# Altium schematic sheet LatchDelay.SchDoc
size Letter; DocumentNumber: 4; SheetNumber: 4; SheetTotal: 7
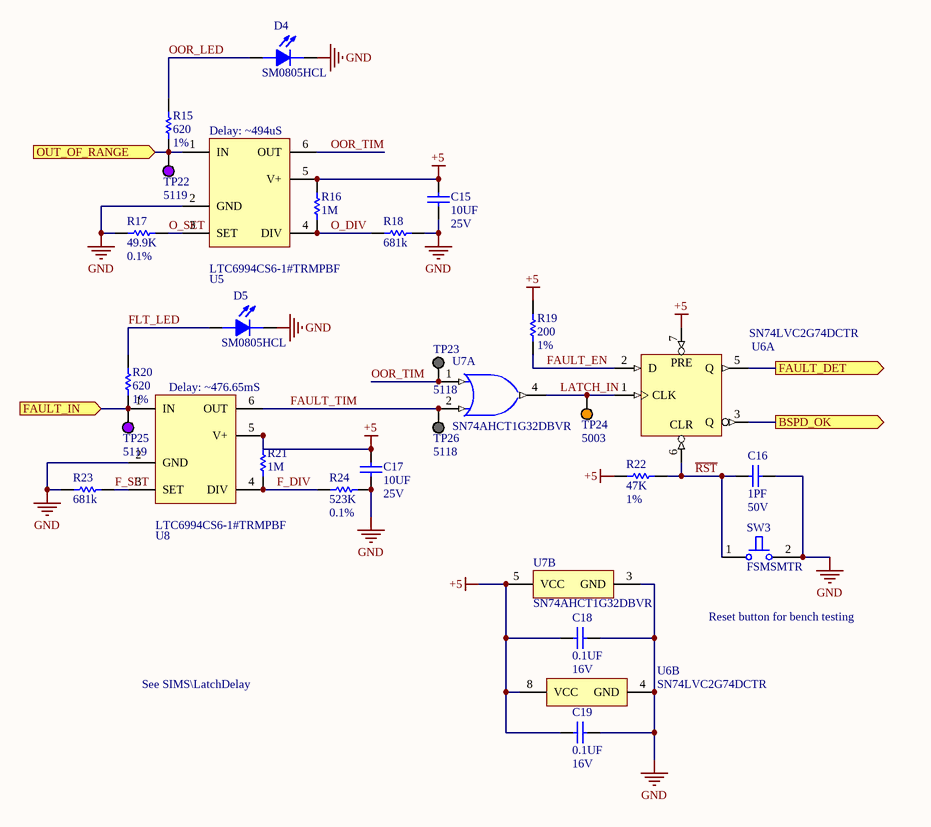
[diagram p0: LatchDelay.SchDoc]

## Parts
C15  Val: 10UF  Vol: 25V  [0603_CAP]  (hidden comment: CAP 0603 10UF 25V 20% X5R)
C16  Val: 1PF  Vol: 50V  [0603_CAP]  (hidden comment: CAP 0603 1PF 50V 0.05PF MLO)
C17  Val: 10UF  Vol: 25V  [0603_CAP]  (hidden comment: CAP 0603 10UF 25V 20% X5R)
C18  Val: 0.1UF  Vol: 16V  [0603_CAP]  (hidden comment: CAP 0603 0.1UF 16V 10% X7R)
C19  Val: 0.1UF  Vol: 16V  [0603_CAP]  (hidden comment: CAP 0603 0.1UF 16V 10% X7R)
D4  SM0805HCL  [LEDC2012X135N_SM0805HCL(Primary)]
D5  SM0805HCL  [LEDC2012X135N_SM0805HCL(Primary)]
R15  Val: 620  Tol: 1%  [0603_RES]  (hidden comment: RES 0603 620 1%)
R16  value 1M  [RESC2013X60X35ML10T20]  (hidden comment: RT0805BRE071ML)
R17  Val: 49.9K  Tol: 0.1%  [0603_RES]  (hidden comment: RES 0603 49.9K 0.1%)
R18  value 681k  [RESC2013X60X40NL20T25]  (hidden comment: ERA6AEB6813V)
R19  Val: 200  Tol: 1%  [0603_RES]  (hidden comment: RES 0603 200 1%)
R20  Val: 620  Tol: 1%  [0603_RES]  (hidden comment: RES 0603 620 1%)
R21  value 1M  [RESC2013X60X35ML10T20]  (hidden comment: RT0805BRE071ML)
R22  Val: 47K  Tol: 1%  [0603_RES]  (hidden comment: RES 0603 47K 1%)
R23  value 681k  [RESC2013X60X40NL20T25]  (hidden comment: ERA6AEB6813V)
R24  Val: 523K  Tol: 0.1%  [0805_RES]  (hidden comment: RES 0805 523K 0.1%)
SW3  FSMSMTR  [TECO-FSMSMTR_V]
TP22  5119  [KSTN-5119]
TP23  5118  [KSTN-5118]
TP24  5003  [KSTN-5003]
TP25  5119  [KSTN-5119]
TP26  5118  [KSTN-5118]
U5  LTC6994CS6-1#TRMPBF  [Linear_Technologies_LTC6994CS6-1#TRMPBF_0]  (value not drawn)
U6  SN74LVC2G74DCTR  [DCT0008A_M]  (parts A,B of 2)
U7  SN74AHCT1G32DBVR  [DBV0005A_M]  (parts A,B of 2)
U8  LTC6994CS6-1#TRMPBF  [Linear_Technologies_LTC6994CS6-1#TRMPBF_0]  (value not drawn)

## Ports
BSPD_OK (out), FAULT_DET (out), FAULT_IN (in), OUT_OF_RANGE (in)

## Nets
+5: C15.2 C17.2 C18.2 C19.2 R16.2 R19.2 R21.2 R22.1 U5.5(V+) U6.7(~{PRE}) U6.8(VCC) U7.5(VCC) U8.5(V+)
GND: C15.1 C16.2 C17.1 C18.1 C19.1 D4.C D5.C R17.1 R18.2 R23.1 R24.2 SW3.2 U5.2(GND) U6.4(GND) U7.3(GND) U8.2(GND)
~{RST}: C16.1 R22.2 SW3.1 U6.6(~{CLR})
BSPD_OK: U6.3(Q) ; port BSPD_OK
F_DIV: R21.1 R24.1 U8.4(DIV)
F_SET: R23.2 U8.3(SET)
FAULT_DET: U6.5(Q) ; port FAULT_DET
FAULT_EN: R19.1 U6.2(D)
FAULT_IN: R20.1 TP25.1 U8.1(IN) ; port FAULT_IN
FAULT_TIM: TP26.1 U7.2(B) U8.6(OUT)
FLT_LED: D5.A R20.2
LATCH_IN: TP24.1 U6.1(CLK) U7.4(Y)
O_DIV: R16.1 R18.1 U5.4(DIV)
O_SET: R17.2 U5.3(SET)
OOR_LED: D4.A R15.2
OOR_TIM: TP23.1 U5.6(OUT) U7.1(A)
OUT_OF_RANGE: R15.1 TP22.1 U5.1(IN) ; port OUT_OF_RANGE

## Notes on the sheet
- (near U5) Delay: ~494uS
- (near U8) Delay: ~476.65mS
- Reset button for bench testing
- See SIMS\LatchDelay
- Title:
- Size:
- Date:
- Desc:
- Letter
- Auth:
- Sheet
- Proj:
- of
- www.uvmaero.org
- File:
- (in symbol CMP-0859-00537-3, part A) PRE; CLR

## Library data of the parts
C15 C17 = CAP 0603 10UF 25V 20% X5R: Capacitor Surface Mount 0603 Footprint 10UF 25V 20% Tolerance Ceramic X5R; Manufacturer: Various; PCB Package: 0603; Description in Visual: Cap SMT 0603 10UF 25V 20% Ceramic X5R; P/N: CAP 0603 10UF 25V 20% X5R; Manufacturer P/N: Various; Value: 10UF; Voltage: 25V; Tolerance: 20%; Type: Ceramic X5R; ComponentLink1Description: Manufacturer Website; ComponentLink2Description: Component Datasheet; ComponentLink3Description: Octopart Link
C16 = CAP 0603 1PF 50V 0.05PF MLO: Capacitor Surface Mount 0603 Footprint 1PF 50V 0.05PF Tolerance MLO; Manufacturer: Various; PCB Package: 0603; Description in Visual: Cap SMT 0603 1PF 50V 0.05PF  MLO; P/N: CAP 0603 1PF 50V 0.05PF MLO; Manufacturer P/N: Various; Value: 1PF; Voltage: 50V; Tolerance: 0.05PF; Type: MLO; ComponentLink1Description: Manufacturer Website; ComponentLink2Description: Component Datasheet; ComponentLink3Description: Octopart Link
C18 C19 = CAP 0603 0.1UF 16V 10% X7R: Capacitor Surface Mount 0603 Footprint 0.1UF 16V 10% Tolerance Ceramic X7R; Manufacturer: Various; PCB Package: 0603; Description in Visual: Cap SMT 0603 0.1UF 16V 10%  Cer X7R; P/N: CAP 0603 0.1UF 16V 10% X7R; Manufacturer P/N: Various; Value: 0.1UF; Voltage: 16V; Tolerance: 10%; Type: Ceramic X7R; ComponentLink1Description: Manufacturer Website; ComponentLink2Description: Component Datasheet; ComponentLink3Description: Octopart Link
D4 D5 = SM0805HCL: Red 631nm LED Indication - Discrete 1.9V 0805 (2012 Metric); Supplier 1: Digi-Key; Supplier Part Number 1: 492-2281-1-ND
R15 R20 = RES 0603 620 1%: Resistor Surface Mount, 620 Ohms, 0603 Footprint, 1% Tolerance 0.1W; Manufacturer: Various; PCB Package: 0603; Description in Visual: Res SMT 620 0603  1%  0.1W; Value: 620; P/N: RES 0603 620 1%; Manufacturer P/N: Various; Power_Rating: 0.1W; Tolerance: 1%
R16 R21 = CMP-2001-01491-1: Manufacturer: Yageo; Part Number: RT0805BRE071ML
R17 = RES 0603 49.9K 0.1%: Resistor Surface Mount, 49.9K Ohms, 0603 Footprint, 0.1% Tolerance 0.1W; Manufacturer: Various; PCB Package: 0603; Description in Visual: Res SMT 49.9K 0603  0.1%  0.1W; P/N: RES 0603 49.9K 0.1%; Manufacturer P/N: Various; Value: 49.9K; Power_Rating: 0.1W; Tolerance: 0.1%
R18 R23 = CMP-2001-00870-1: Manufacturer: Panasonic; Part Number: ERA6AEB6813V
R19 = RES 0603 200 1%: Resistor Surface Mount, 200 Ohms, 0603 Footprint, 1% Tolerance 0.1W; Manufacturer: Various; PCB Package: 0603; Description in Visual: Res SMT 200 0603  1%  0.1W; Value: 200; P/N: RES 0603 200 1%; Manufacturer P/N: Various; Power_Rating: 0.1W; Tolerance: 1%
R22 = RES 0603 47K 1%: Resistor Surface Mount, 47K Ohms, 0603 Footprint, 1% Tolerance 0.1W; Manufacturer: Various; PCB Package: 0603; Description in Visual: Res SMT 47K 0603  1%  0.1W; P/N: RES 0603 47K 1%; Manufacturer P/N: Various; Value: 47K; Power_Rating: 0.1W; Tolerance: 1%
R24 = RES 0805 523K 0.1%: Resistor Surface Mount, 523K Ohms, 0805 Footprint, 0.1% Tolerance 0.125W; Manufacturer: Various; PCB Package: 0805; Description in Visual: Res SMT 523K 0805  0.1%  0.125W; P/N: RES 0805 523K 0.1%; Manufacturer P/N: Various; Value: 523K; Power_Rating: 0.125W; Tolerance: 0.1%
SW3 = FSMSMTR: FSMSM Push Button Switch, 50 mA, -35 to 85 degC, 2-Pin SMD, RoHS, Tape and Reel; Manufacturer: TE Connectivity; Voltage Rating (DC): 24V; Electrical Life: 20000Cycles; Operating Force: 180gf; Switch Travel: 0.25mm; Contact Current Rating: 50mA; Case\/Package: SMD/SMT; Actuator Length: 1.07mm; Throw Configuration: SPST; Actuator Material: Polyamide; Contact Resistance: 100mOhm; Illumination Type: Illuminated; Max Voltage Rating (DC): 12V; Manufacturer URL: http://www.te.com/; Lead Free: LeadFree; Packaging: TapeandReel; Min Operating Temperature: -35degC; Mechanical Life: 20000Cycles; Mount: SurfaceMount; REACH SVHC: Unknown; Package Quantity: 1800; Package Reference: FSMSMTR; RoHSCompliant: true; Max Operating Temperature: 85degC; Orientation: Straight; ELV: Compliant; Datasheet URL: http://www.te.com/commerce/DocumentDelivery/DDEController?Action=showdoc&DocId=Customer+Drawing%7F1437566-3%7FC2%7Fpdf%7FEnglish%7FENG_CD_1437566-3_C2_1437566_3_1_c.dwg.pdf%7F1437566-4; Package Description: 2-Pin Surface Mount Device, Body 6 x 3.5 mm, Pitch 9.19 mm; Current Rating: 50mA; Contact Plating: Silver; Termination: GullWing; Datasheet Version: Rev. C2, 08/2014; Contact Material: Brass; Mounting Technology: SurfaceMount; Manufacturer 1: TE Connectivity; Manufacturer Part Number 1: FSMSMTR; Supplier 1: Digi-Key; Supplier Part Number 1: 450-1758-1-ND
TP22 TP25 = 5119: Test Point, Purple, 1-Pin THD, RoHS, Bulk; Manufacturer: KeystoneElectronics; Outside Diameter: 2.54mm; Plating: Silver; Mounting Hole Size: 1mm; Product: TestPoints; Packaging: Bulk; Manufacturer URL: http://www.keyelco.com/; Length: 7.62mm; Datasheet Version: Rev. G, 12/2008; Type: Miniature; Product Category: CircuitBoardHardware-PCB; Material: Nylon; RoHS: True; Contact Material: PhosphorBronze; Datasheet URL: https://ciiva.com/datasheet-click-2917627?src=ciiva&sig=bd195616; Color: Purple; Brand: KeystoneElectronics; Supplier 1: Digi-Key; Supplier Part Number 1: 36-5119-ND
TP23 TP26 = 5118: Test Point, Grey, 1-Pin THD, RoHS, Bulk; Manufacturer: KeystoneElectronics; Outside Diameter: 2.54mm; Plating: Silver; Mounting Hole Size: 1mm; Product: TestPoints; Packaging: Bulk; Manufacturer URL: http://www.keyelco.com/; Length: 7.62mm; Datasheet Version: Rev. G, 12/2008; Type: Miniature; Product Category: CircuitBoardHardware-PCB; Material: Nylon; RoHS: True; Contact Material: PhosphorBronze; Datasheet URL: https://ciiva.com/datasheet-click-2917627?src=ciiva&sig=bd195616; Color: Grey; Brand: KeystoneElectronics; Supplier 1: Digi-Key; Supplier Part Number 1: 36-5118-ND
TP24 = 5003: Test Point, Orange, 1-Pin THD, RoHS, Bulk; Manufacturer: KeystoneElectronics; Outside Diameter: 2.54mm; Plating: Silver; Mounting Hole Size: 1mm; Product: TestPoints; Packaging: Bulk; Manufacturer URL: http://www.keyelco.com/; Length: 7.62mm; Datasheet Version: Rev. G, 12/2008; Type: Miniature; Product Category: CircuitBoardHardware-PCB; Material: Nylon; RoHS: True; Contact Material: PhosphorBronze; Datasheet URL: https://ciiva.com/datasheet-click-2917627?src=ciiva&sig=bd195616; Color: Orange; Brand: KeystoneElectronics; Supplier 1: Digi-Key; Supplier Part Number 1: 36-5003-ND
U5 U8 = LTC6994CS6-1#TRMPBF: IC DELAY LINE 8TAP PROG TSOT23-6; Manufacturer: Linear Technologies; Capacitance: SKIP; Library Path1: parts/IC_Linear_Technologies_LTC6994CS6-1#TRMPBF_eec.SchLib; Value: SKIP; Part Number: LTC6994CS6-1#TRMPBF; Datasheet Path: datasheets/IC_Linear_Technologies_LTC6994CS6-1#TRMPBF_eec.pdf; ComponentLink1Description: Upverter; ComponentLink1URL: https://upverter.com/upn/revision/f62c3d807553aaaa/; ComponentLink2Description: Datasheet; ComponentLink2URL: http://cds.linear.com/docs/en/datasheet/699412fb.pdf; Datasheet Path1: datasheets/IC_Linear_Technologies_LTC6994CS6-1#TRMPBF_eec.pdf; Digikey Description: IC DELAY LINE 8TAP PROG TSOT23-6; Digikey Part Number: LTC6994CS6-1#TRMPBFCT-ND; Inductance: SKIP; Lead Free: yes; Library Ref1: LTC6994CS6-1#TRMPBF; Mouser Part Number: 584-C6994CS6-1TRMPBF; Package: TSOT23-6; Price: 2.01987952065; Resistance: SKIP; RoHS: TRUE; Supplier 1: Digi-Key; Supplier 2: Mouser; Supplier Part Number 1: LTC6994CS6-1#TRMPBFCT-ND; Supplier Part Number 2: 584-C6994CS6-1TRMPBF; Temperature: 0°C to +70°C; Temperature Range High: +70°C; Temperature Range Low: 0°C; Voltage: SKIP; helpURL: https://upverter.com/upn/revision/f62c3d807553aaaa/
U6 = CMP-0859-00537-3: Single Positive-Edge-Triggered D-Type Flip-Flop with Clear and Preset, DCT0008A, LARGE T&R; Manufacturer: Texas Instruments; Output Type: CMOS; Schmitt Trigger: No; ICC @ Nom Voltage(Max)(mA): 0.01; VCC(Max)(V): 5.5; Output Drive (IOL/IOH)(Max)(mA): 32/-32; Input Type: CMOS/TTL; Rating: Catalog; Technology Family: LVC; Bits(#): 1; F @ Nom Voltage(Max)(Mhz): 150; tpd @ Nom Voltage(Max)(ns): 13.4,7.1,5.9,4.1; Voltage(Nom)(V): 1.8,2.5,3.3,5; Logic: True; VCC(Min)(V): 1.65; Operating Temperature Range(C): -40 to 125,-40 to 85; Sub-Family: D-Type Flip-Flop; Generic Part Number: SN74LVC2G74; 3-State Output: No; PackageReference: DCT0008A; DatasheetVersion: SCES203O
U7 = CMP-0859-00067-3: Single 2-Input Positive-OR Gate, DBV0005A, LARGE T&R; Manufacturer: Texas Instruments; Technology Family: AHCT; VCC(Min)(V): 2; Voltage(Nom)(V): 5; Schmitt Trigger: No; Gate Type: OR; Sub-Family: OR Gate; Input Type: CMOS; ICC @ Nom Voltage(Max)(mA): 0.01; VCC(Max)(V): 5.5; Bits(#): 1; F @ Nom Voltage(Max)(Mhz): 75; Output Drive (IOL/IOH)(Max)(mA): 8/-8; tpd @ Nom Voltage(Max)(ns): 8; Logic: True; Rating: Catalog; Operating Temperature Range(C): -40 to 125; Generic Part Number: SN74AHCT1G32; DatasheetVersion: SCLS320O; PackageReference: DBV0005A; 3-State Output: No; Output Type: CMOS